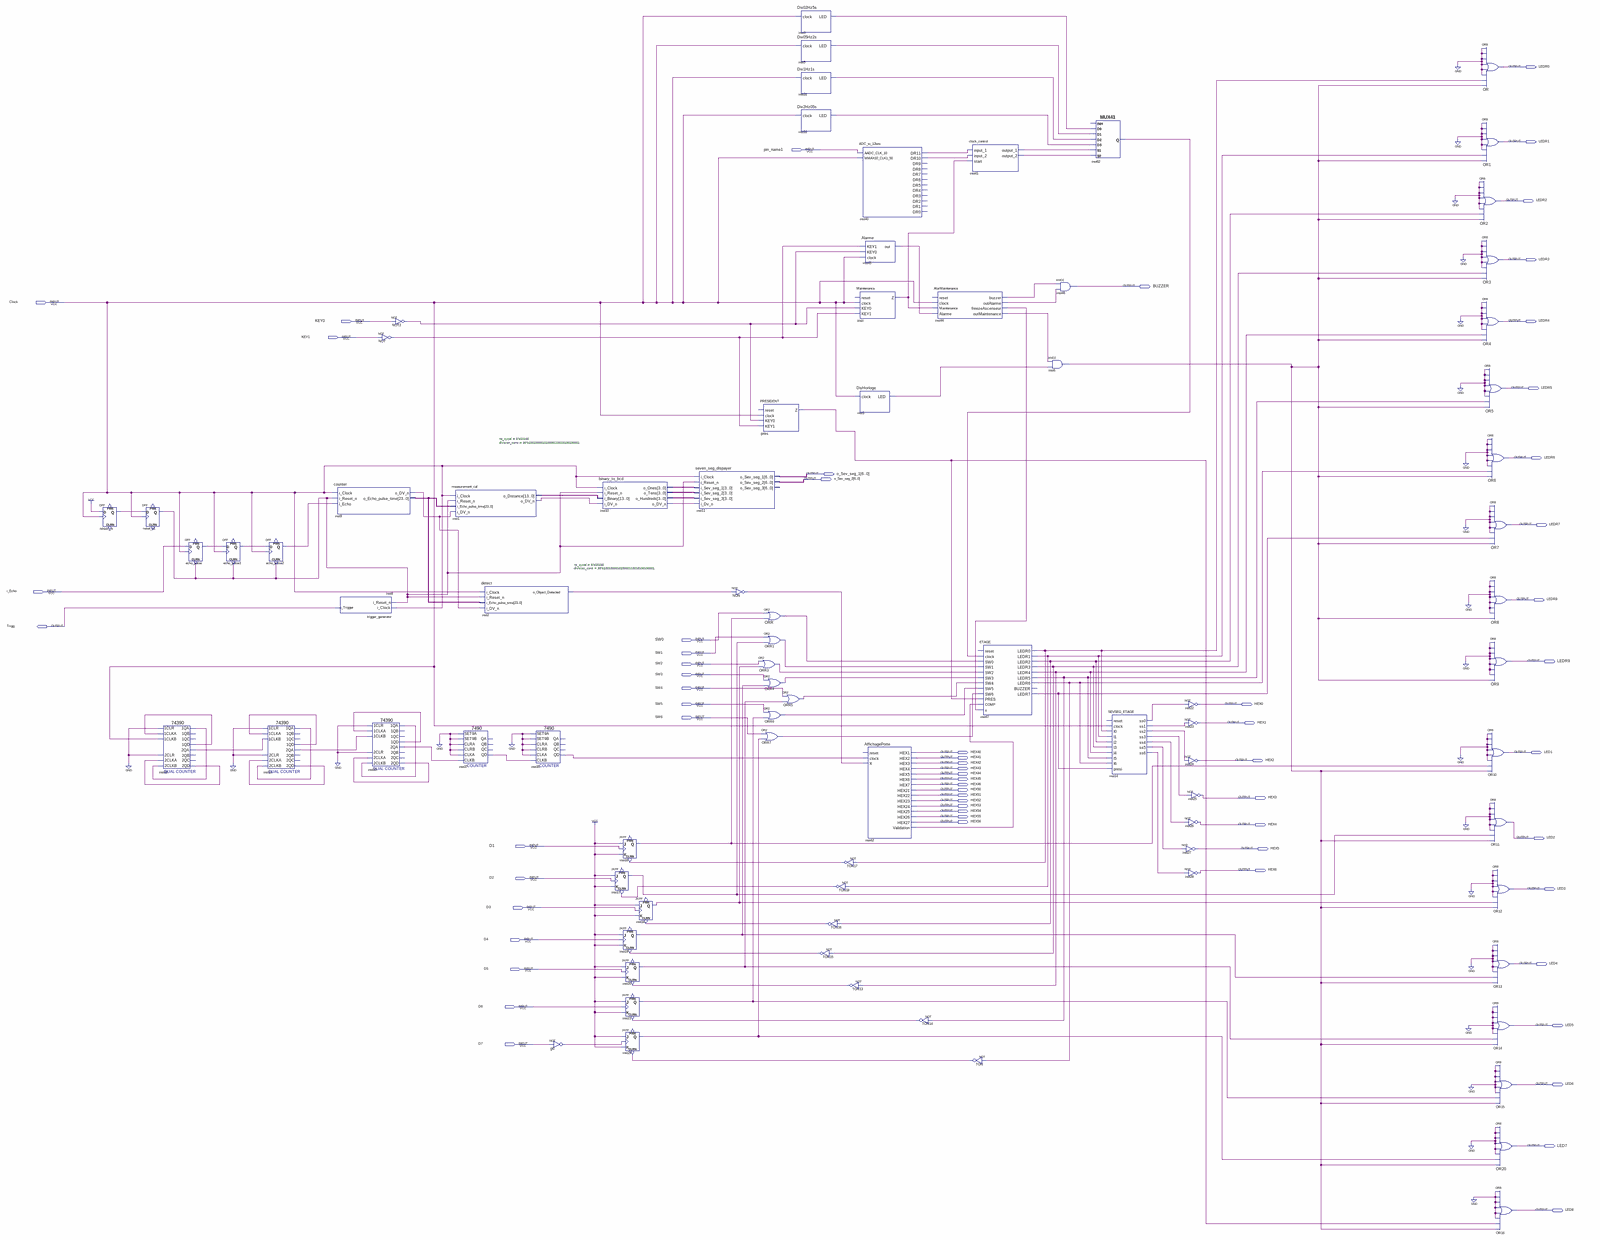
[diagram p0: schematic sheet, whole]
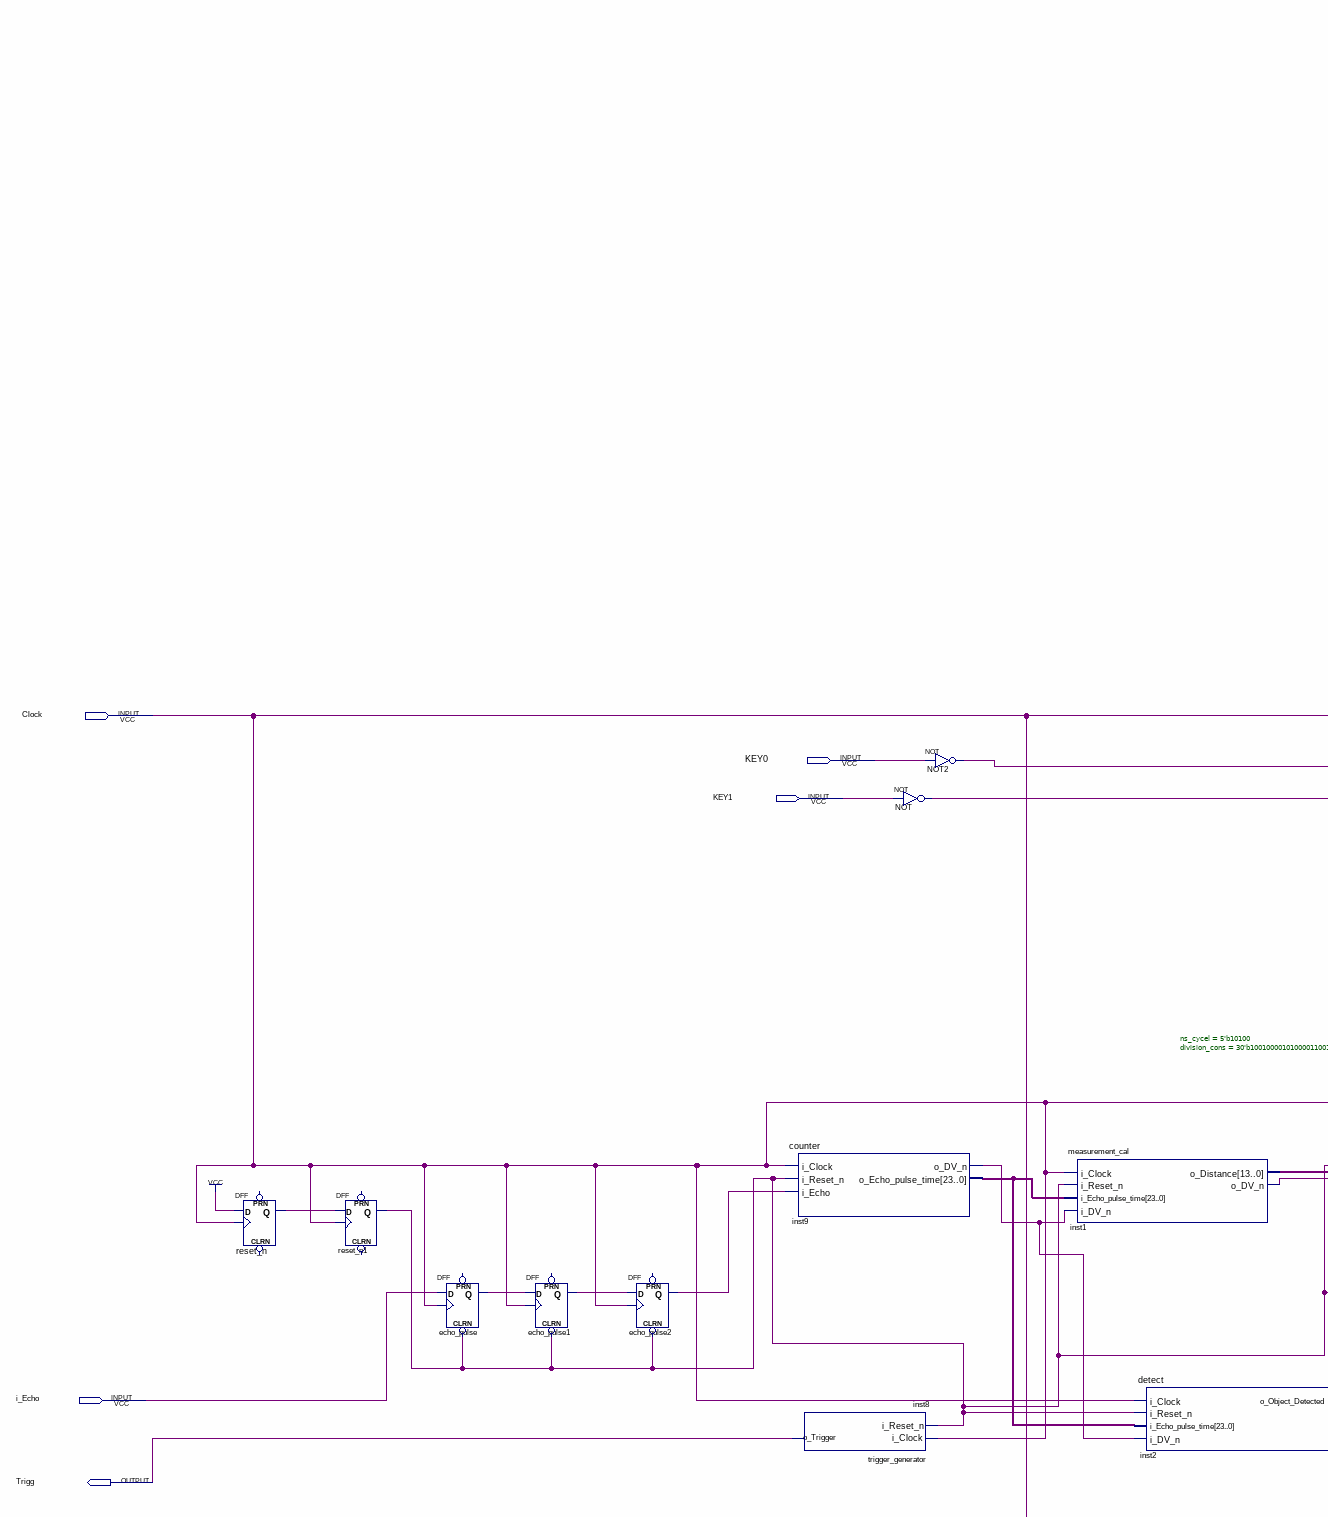
[diagram p1: schematic sheet, upper left part]
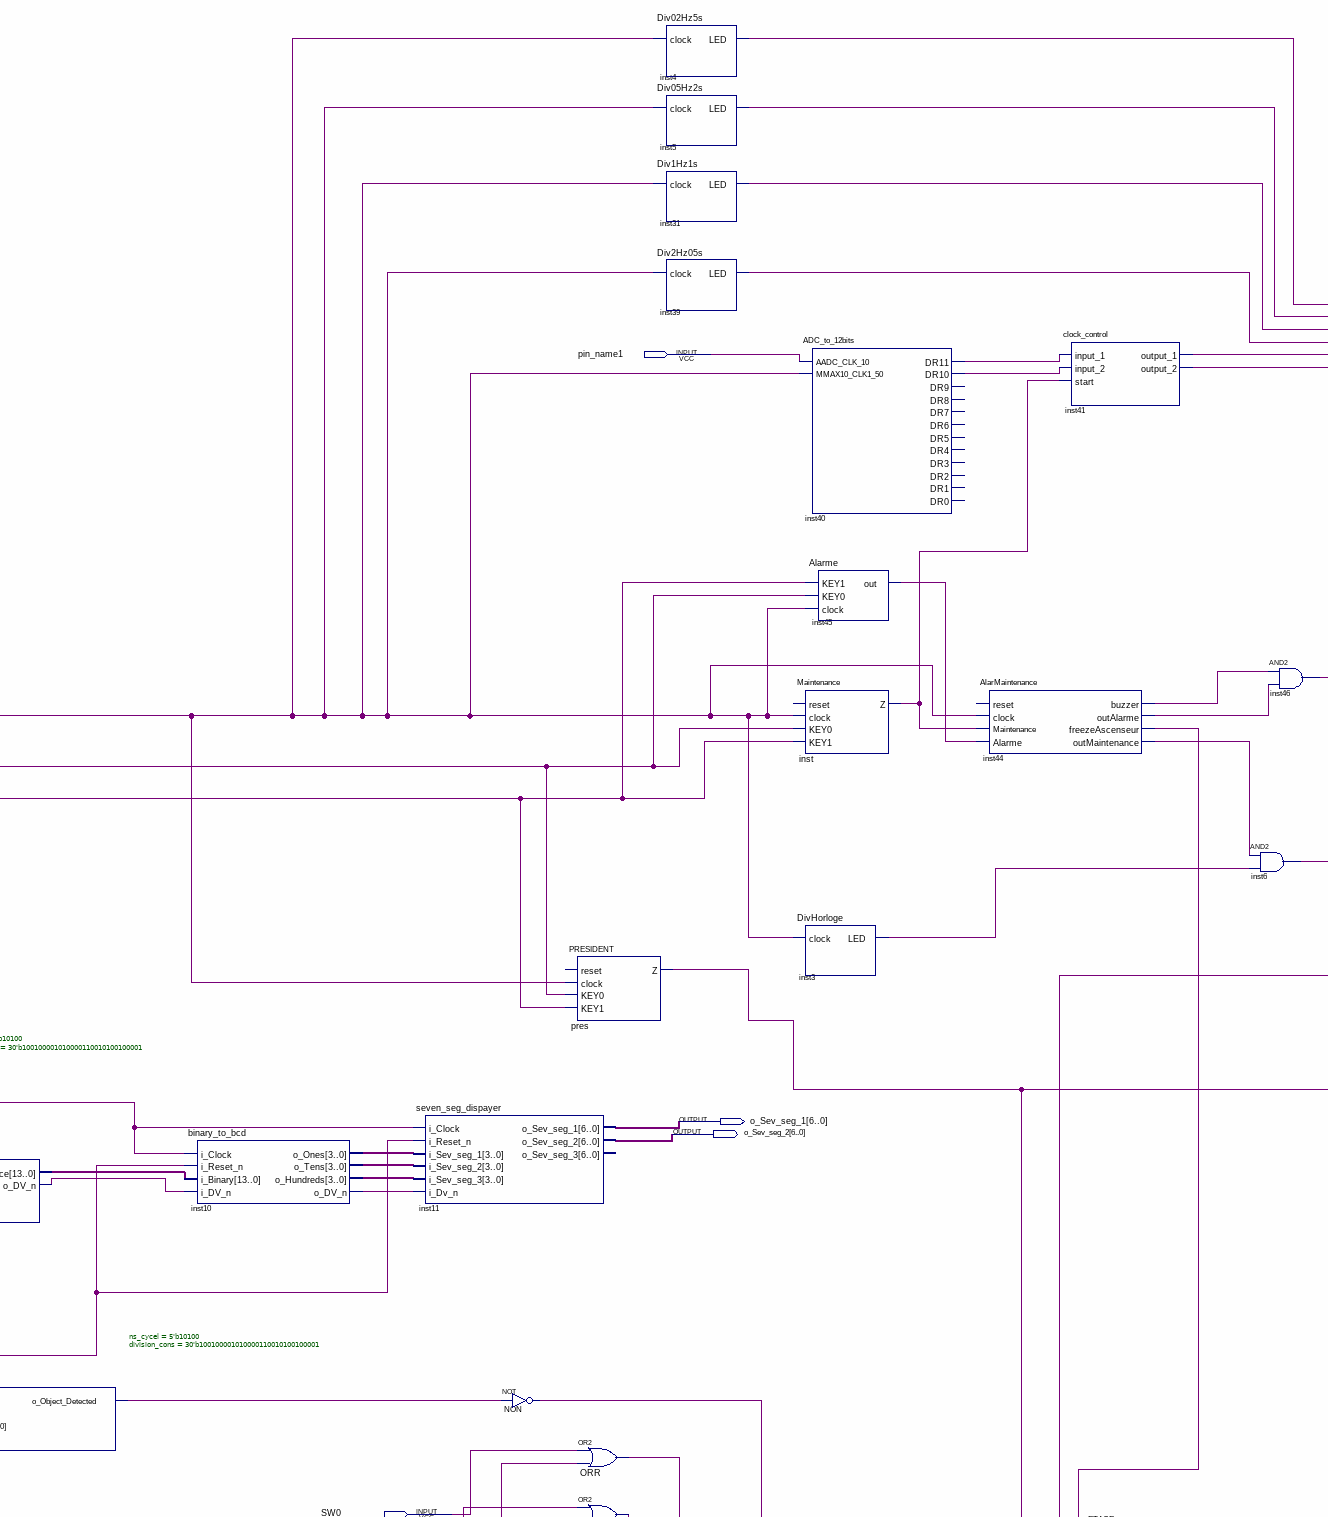
[diagram p2: schematic sheet, upper centre part]
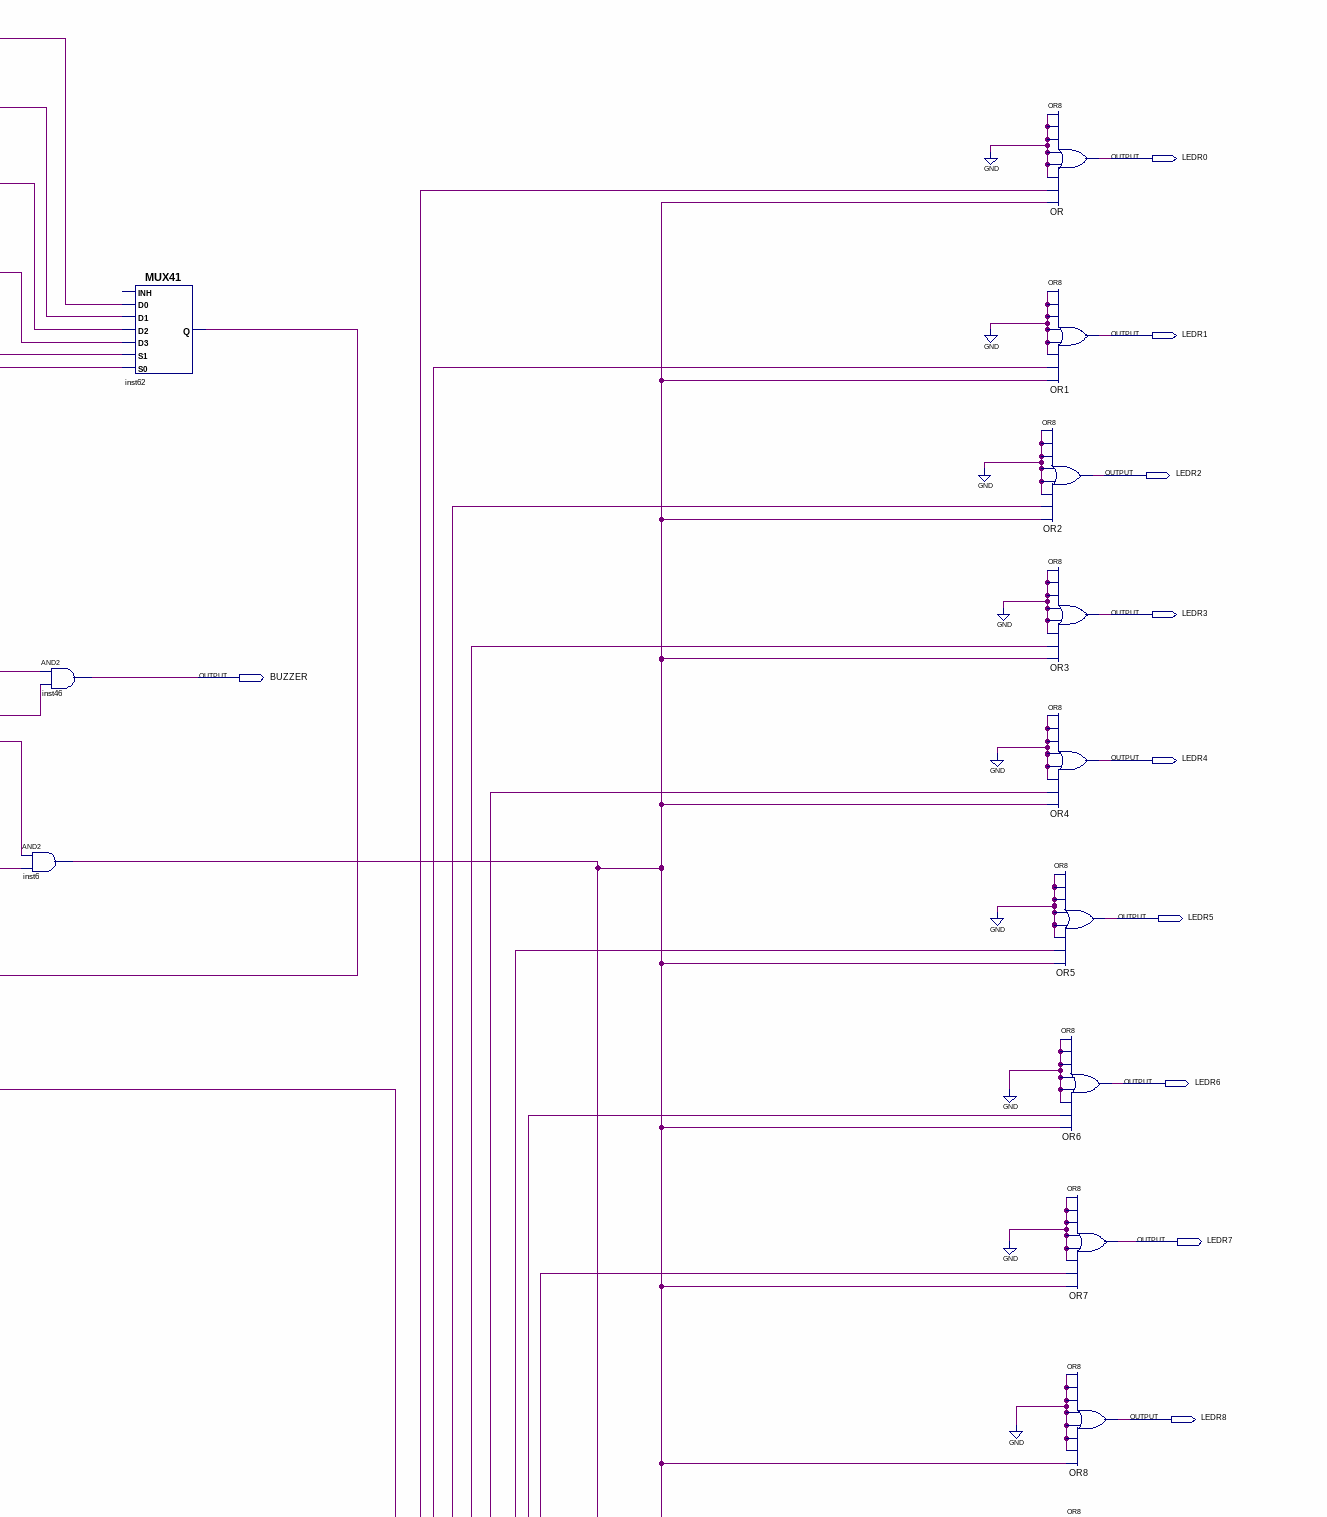
[diagram p3: schematic sheet, upper right part]
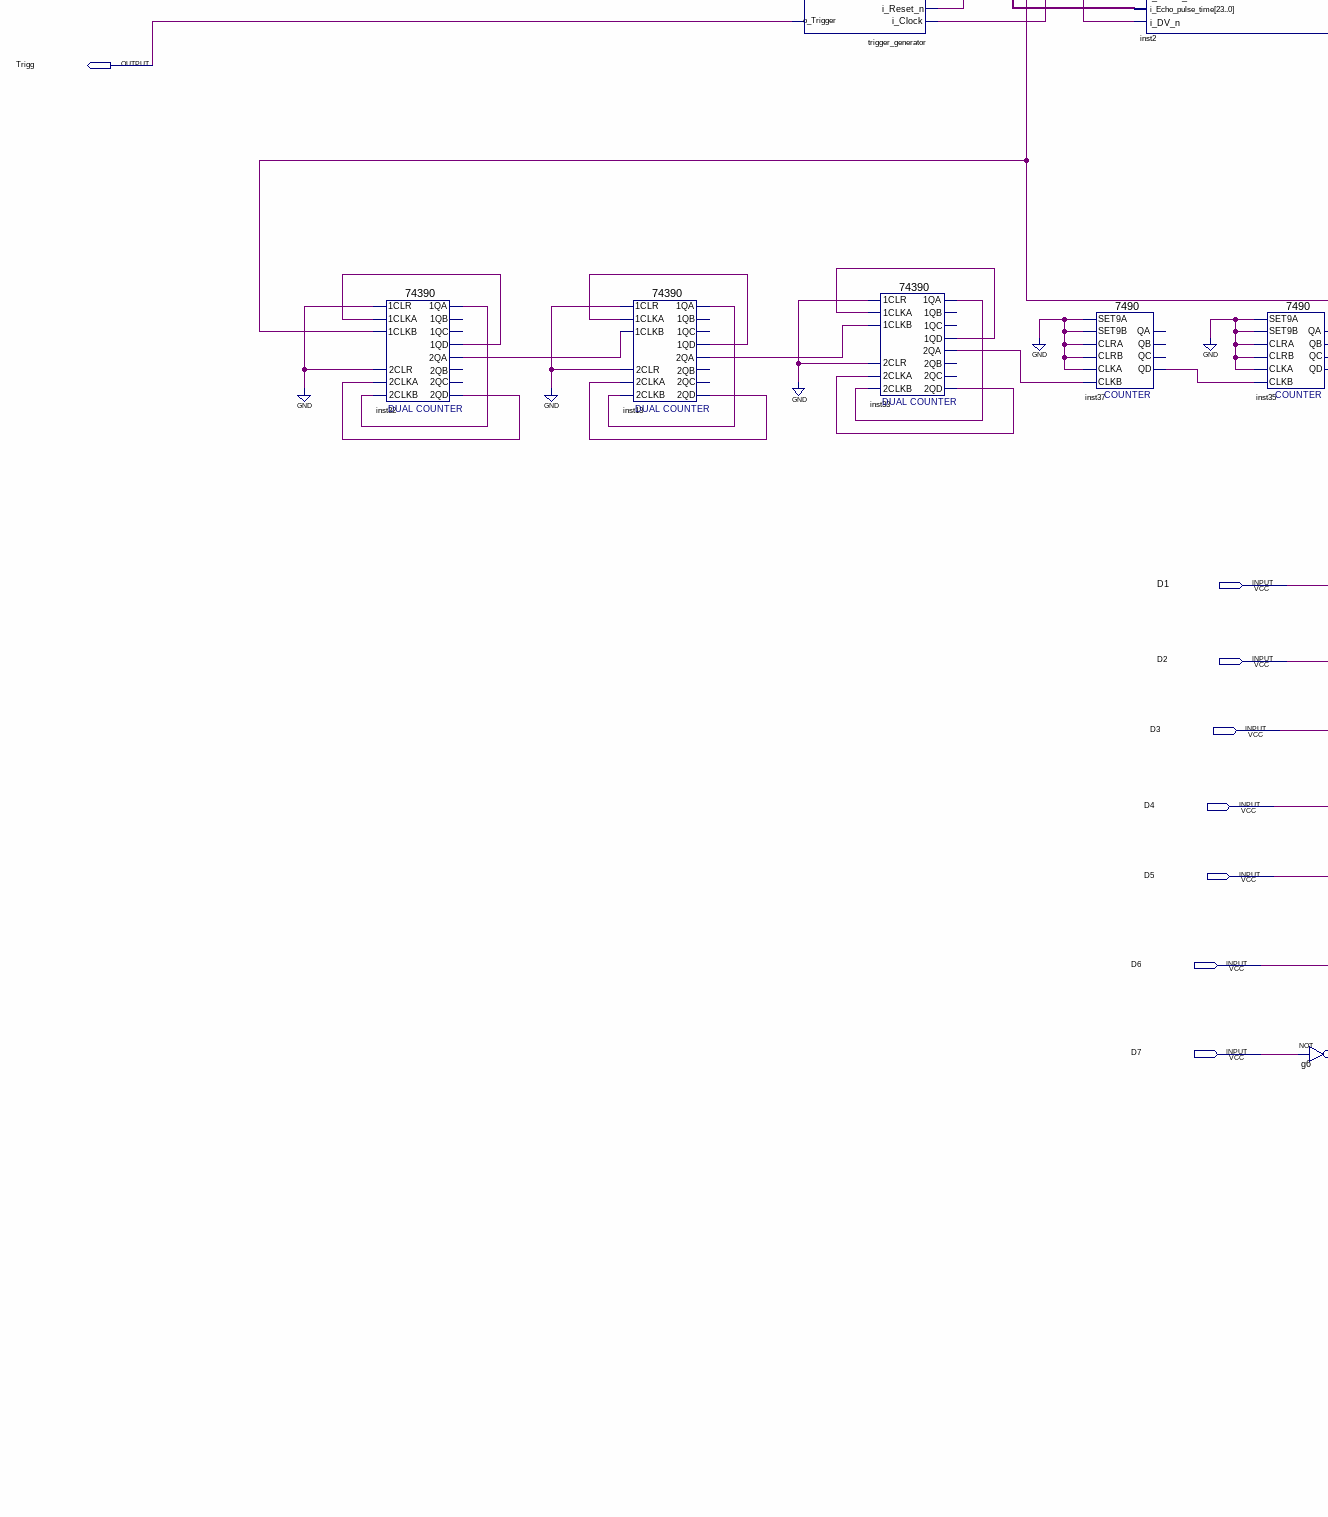
[diagram p4: schematic sheet, lower left part]
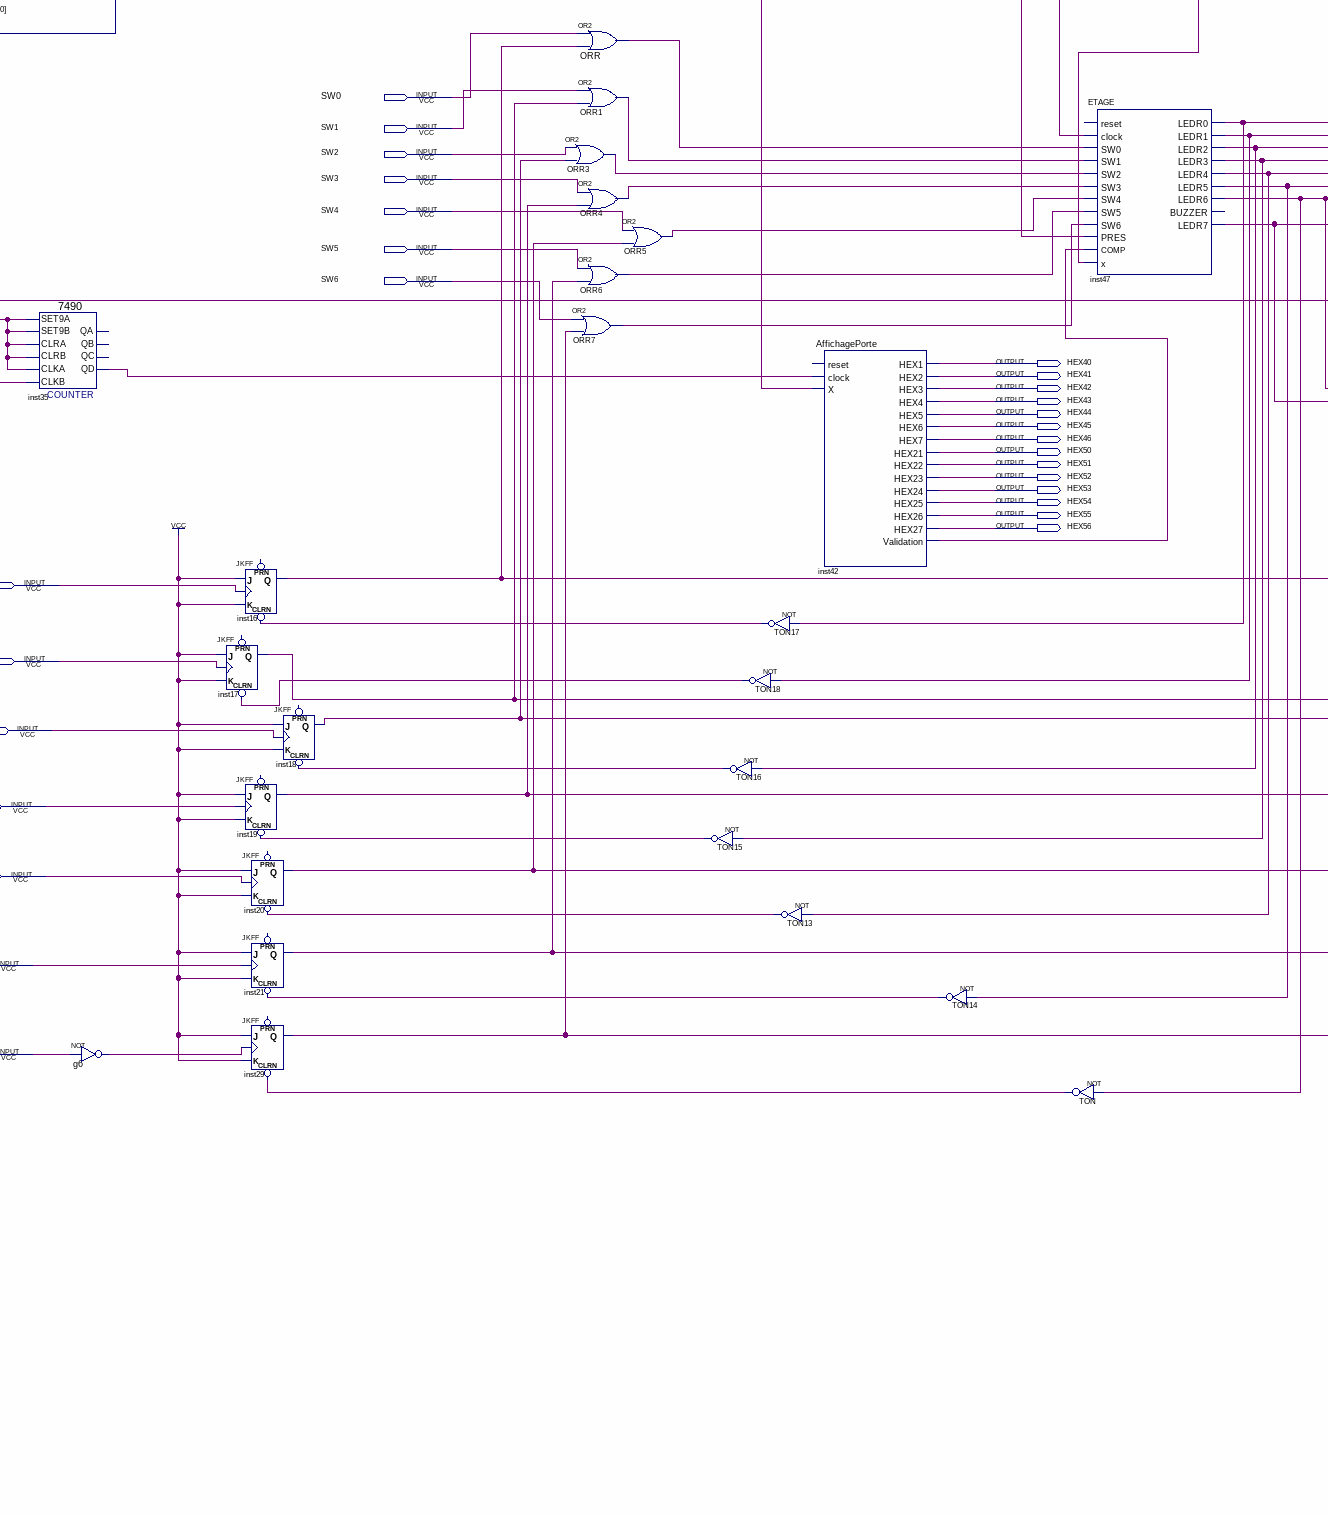
[diagram p5: schematic sheet, lower centre part]
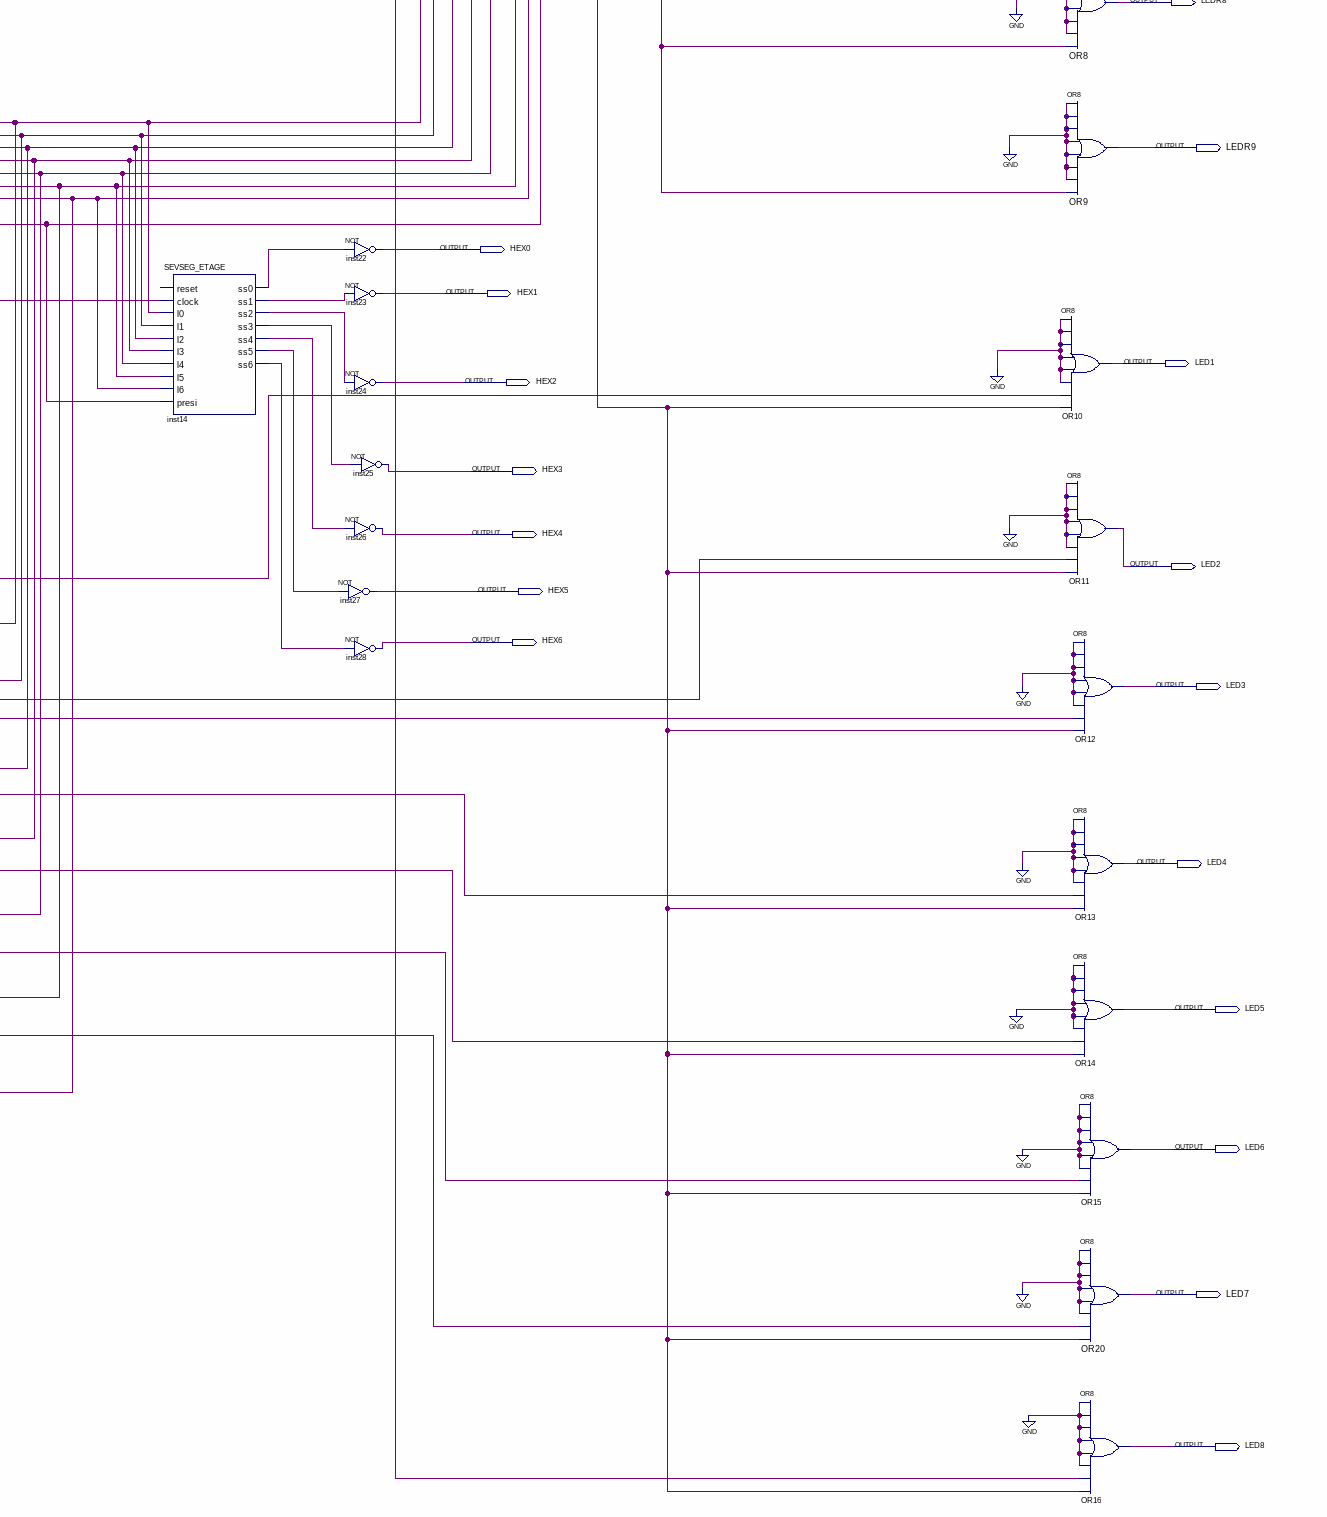
[diagram p6: schematic sheet, lower right part]
// Quartus schematic Quartus.bdf as structural Verilog: 83 symbols, 62 pins
module Quartus (
  input  pin_name1,
  input  Clock,
  input  KEY0,
  input  KEY1,
  input  i_Echo,
  input  SW0,
  input  SW1,
  input  SW2,
  input  SW3,
  input  SW4,
  input  SW5,
  input  SW6,
  input  D1,
  input  D2,
  input  D3,
  input  D4,
  input  D5,
  input  D6,
  input  D7,
  output LEDR0,
  output LEDR1,
  output LEDR2,
  output LEDR3,
  output BUZZER,
  output LEDR4,
  output LEDR5,
  output LEDR6,
  output [6:0] o_Sev_seg_1,
  output [6:0] o_Sev_seg_2,
  output LEDR7,
  output LEDR8,
  output Trigg,
  output LEDR9,
  output HEX0,
  output HEX1,
  output HEX40,
  output LED1,
  output HEX41,
  output HEX2,
  output HEX42,
  output HEX43,
  output HEX44,
  output HEX45,
  output HEX46,
  output HEX50,
  output HEX51,
  output HEX3,
  output HEX52,
  output HEX53,
  output HEX54,
  output HEX55,
  output HEX56,
  output HEX4,
  output LED2,
  output HEX5,
  output HEX6,
  output LED3,
  output LED4,
  output LED5,
  output LED6,
  output LED7,
  output LED8
);

  wire echo_pulse1_q, echo_pulse2_q, echo_pulse_q, g6_out, inst1_o_dv_n, inst2_o_object_detected, inst3_led,
       inst4_led, inst5_led, inst6_out, inst9_o_dv_n, inst10_o_dv_n, inst13_1qa, inst13_1qd, inst13_2qa,
       inst13_2qd, inst14_ss0, inst14_ss1, inst14_ss2, inst14_ss3, inst14_ss4, inst14_ss5, inst14_ss6,
       inst16_q, inst17_q, inst18_q, inst19_q, inst20_q, inst21_q, inst29_q, inst31_led, inst32_1qa,
       inst32_1qd, inst32_2qa, inst32_2qd, inst33_1qa, inst33_1qd, inst33_2qa, inst33_2qd, inst35_qd,
       inst37_qd, inst39_led, inst40_dr10, inst40_dr11, inst41_output_1, inst41_output_2, inst42_validation,
       inst44_buzzer, inst44_freezeascenseur, inst44_outalarme, inst44_outmaintenance, inst45_out,
       inst47_ledr0, inst47_ledr1, inst47_ledr2, inst47_ledr3, inst47_ledr4, inst47_ledr5, inst47_ledr6,
       inst47_ledr7, inst62_q, inst_z, NON_out, NOT2_out, NOT_out, ORR1_out, ORR3_out, ORR4_out, ORR5_out,
       ORR6_out, ORR7_out, ORR_out, pres_z, reset_n1_q, reset_n_q, TON13_out, TON14_out, TON15_out,
       TON16_out, TON17_out, TON18_out, TON_out;
  wire [3:0] inst10_o_hundreds, inst10_o_ones, inst10_o_tens;
  wire [13:0] inst1_o_distance;
  wire [23:0] inst9_o_echo_pulse_time;

  DFF reset_n (.CLK(Clock), .D(1'b1), .Q(reset_n_q));  // open: CLRN, PRN
  DFF reset_n1 (.CLK(Clock), .D(reset_n_q), .Q(reset_n1_q));  // open: CLRN, PRN
  \74390  inst32 (
    .\2CLKA (inst32_2qd), .\2CLR (1'b0), .\2CLKB (inst32_1qa), .\1CLR (1'b0), .\1CLKA (inst32_1qd),
    .\1CLKB (Clock), .\1QA (inst32_1qa), .\1QD (inst32_1qd), .\2QA (inst32_2qa), .\2QD (inst32_2qd));  // open: 1QB, 1QC, 2QB, 2QC
  DFF echo_pulse (.CLRN(reset_n1_q), .CLK(Clock), .D(i_Echo), .Q(echo_pulse_q));  // open: PRN
  DFF echo_pulse1 (.CLRN(reset_n1_q), .CLK(Clock), .D(echo_pulse_q), .Q(echo_pulse1_q));  // open: PRN
  DFF echo_pulse2 (.CLRN(reset_n1_q), .CLK(Clock), .D(echo_pulse1_q), .Q(echo_pulse2_q));  // open: PRN
  \74390  inst13 (
    .\2CLKA (inst13_2qd), .\2CLR (1'b0), .\2CLKB (inst13_1qa), .\1CLR (1'b0), .\1CLKA (inst13_1qd),
    .\1CLKB (inst32_2qa), .\1QA (inst13_1qa), .\1QD (inst13_1qd), .\2QA (inst13_2qa), .\2QD (inst13_2qd));  // open: 1QB, 1QC, 2QB, 2QC
  counter inst9 (
    .i_Clock(Clock), .i_Reset_n(reset_n1_q), .i_Echo(echo_pulse2_q), .o_DV_n(inst9_o_dv_n),
    .o_Echo_pulse_time(inst9_o_echo_pulse_time));
  trigger_generator inst8 (.i_Clock(Clock), .i_Reset_n(reset_n1_q), .o_Trigger(Trigg));
  not NOT (NOT_out, KEY1);
  \74390  inst33 (
    .\2CLKA (inst33_2qd), .\2CLR (1'b0), .\2CLKB (inst33_1qa), .\1CLR (1'b0), .\1CLKA (inst33_1qd),
    .\1CLKB (inst13_2qa), .\1QA (inst33_1qa), .\1QD (inst33_1qd), .\2QA (inst33_2qa), .\2QD (inst33_2qd));  // open: 1QB, 1QC, 2QB, 2QC
  not NOT2 (NOT2_out, KEY0);
  measurement_cal #(.ns_cycel(5'b10100), .division_cons(30'b100100001010000110010100100001)) inst1 (
    .i_Clock(Clock), .i_Reset_n(reset_n1_q), .i_Echo_pulse_time(inst9_o_echo_pulse_time),
    .i_DV_n(inst9_o_dv_n), .o_Distance(inst1_o_distance), .o_DV_n(inst1_o_dv_n));
  \7490  inst37 (
    .SET9A(1'b0), .CLRA(1'b0), .SET9B(1'b0), .CLKB(inst33_2qa), .CLKA(1'b0), .CLRB(1'b0), .QD(inst37_qd));  // open: QA, QB, QC
  detect #(.ns_cycel(5'b10100), .division_cons(30'b100100001010000110010100100001)) inst2 (
    .i_Clock(Clock), .i_Reset_n(reset_n1_q), .i_Echo_pulse_time(inst9_o_echo_pulse_time),
    .i_DV_n(inst9_o_dv_n), .o_Object_Detected(inst2_o_object_detected));
  \7490  inst35 (
    .SET9A(1'b0), .CLRA(1'b0), .SET9B(1'b0), .CLKB(inst37_qd), .CLKA(1'b0), .CLRB(1'b0), .QD(inst35_qd));  // open: QA, QB, QC
  not g6 (g6_out, D7);
  binary_to_bcd inst10 (
    .i_Clock(Clock), .i_Reset_n(reset_n1_q), .i_Binary(inst1_o_distance), .i_DV_n(inst1_o_dv_n),
    .o_Ones(inst10_o_ones), .o_Tens(inst10_o_tens), .o_Hundreds(inst10_o_hundreds), .o_DV_n(inst10_o_dv_n));
  JKFF inst16 (.CLRN(TON17_out), .K(1'b1), .J(1'b1), .CLK(D1), .Q(inst16_q));  // open: PRN
  JKFF inst17 (.CLRN(TON18_out), .K(1'b1), .J(1'b1), .CLK(D2), .Q(inst17_q));  // open: PRN
  JKFF inst19 (.CLRN(TON15_out), .K(1'b1), .J(1'b1), .CLK(D4), .Q(inst19_q));  // open: PRN
  JKFF inst18 (.CLRN(TON16_out), .K(1'b1), .J(1'b1), .CLK(D3), .Q(inst18_q));  // open: PRN
  JKFF inst20 (.CLRN(TON13_out), .K(1'b1), .J(1'b1), .CLK(D5), .Q(inst20_q));  // open: PRN
  JKFF inst21 (.CLRN(TON14_out), .K(1'b1), .J(1'b1), .CLK(D6), .Q(inst21_q));  // open: PRN
  JKFF inst29 (.CLRN(TON_out), .K(1'b1), .J(1'b1), .CLK(g6_out), .Q(inst29_q));  // open: PRN
  seven_seg_dispayer inst11 (
    .i_Clock(Clock), .i_Reset_n(reset_n1_q), .i_Sev_seg_1(inst10_o_ones), .i_Sev_seg_2(inst10_o_tens),
    .i_Sev_seg_3(inst10_o_hundreds), .i_Dv_n(inst10_o_dv_n), .o_Sev_seg_1(o_Sev_seg_1),
    .o_Sev_seg_2(o_Sev_seg_2));  // open: o_Sev_seg_3
  not NON (NON_out, inst2_o_object_detected);
  PRESIDENT pres (.clock(Clock), .KEY0(NOT2_out), .KEY1(NOT_out), .Z(pres_z));  // open: reset
  or ORR (ORR_out, SW0, inst16_q);
  or ORR1 (ORR1_out, SW1, inst17_q);
  or ORR3 (ORR3_out, SW2, inst18_q);
  or ORR4 (ORR4_out, SW3, inst19_q);
  or ORR6 (ORR6_out, SW5, inst21_q);
  or ORR7 (ORR7_out, SW6, inst29_q);
  or ORR5 (ORR5_out, SW4, inst20_q);
  Div02Hz5s inst4 (.clock(Clock), .LED(inst4_led));
  Div05Hz2s inst5 (.clock(Clock), .LED(inst5_led));
  Div1Hz1s inst31 (.clock(Clock), .LED(inst31_led));
  Div2Hz05s inst39 (.clock(Clock), .LED(inst39_led));
  not TON18 (TON18_out, inst47_ledr1);
  not TON16 (TON16_out, inst47_ledr2);
  not TON15 (TON15_out, inst47_ledr3);
  Maintenance inst (.clock(Clock), .KEY0(NOT2_out), .KEY1(NOT_out), .Z(inst_z));  // open: reset
  DivHorloge inst3 (.clock(Clock), .LED(inst3_led));
  not TON17 (TON17_out, inst47_ledr0);
  not TON13 (TON13_out, inst47_ledr4);
  ADC_to_12bits inst40 (
    .AADC_CLK_10(pin_name1), .MMAX10_CLK1_50(Clock), .DR11(inst40_dr11), .DR10(inst40_dr10));  // open: DR9, DR8, DR7, DR6, DR5, DR4, DR3, DR2, DR1, DR0
  Alarme inst45 (.KEY1(NOT_out), .KEY0(NOT2_out), .clock(Clock), .out(inst45_out));
  AffichagePorte inst42 (
    .clock(inst35_qd), .X(NON_out), .HEX1(HEX40), .HEX2(HEX41), .HEX3(HEX42), .HEX4(HEX43), .HEX5(HEX44),
    .HEX6(HEX45), .HEX7(HEX46), .HEX21(HEX50), .HEX22(HEX51), .HEX23(HEX52), .HEX24(HEX53), .HEX25(HEX54),
    .HEX26(HEX55), .HEX27(HEX56), .Validation(inst42_validation));  // open: reset
  not TON14 (TON14_out, inst47_ledr5);
  AlarMaintenance inst44 (
    .clock(Clock), .Maintenance(inst_z), .Alarme(inst45_out), .buzzer(inst44_buzzer),
    .outAlarme(inst44_outalarme), .freezeAscenseur(inst44_freezeascenseur),
    .outMaintenance(inst44_outmaintenance));  // open: reset
  clock_control inst41 (
    .input_1(inst40_dr11), .input_2(inst40_dr10), .start(inst_z), .output_1(inst41_output_1),
    .output_2(inst41_output_2));
  ETAGE inst47 (
    .clock(inst62_q), .SW0(ORR_out), .SW1(ORR1_out), .SW2(ORR3_out), .SW3(ORR4_out), .SW4(ORR5_out),
    .SW5(ORR6_out), .SW6(ORR7_out), .PRES(pres_z), .COMP(inst42_validation), .x(inst44_freezeascenseur),
    .LEDR0(inst47_ledr0), .LEDR1(inst47_ledr1), .LEDR2(inst47_ledr2), .LEDR3(inst47_ledr3),
    .LEDR4(inst47_ledr4), .LEDR5(inst47_ledr5), .LEDR6(inst47_ledr6), .LEDR7(inst47_ledr7));  // open: reset, BUZZER
  not TON (TON_out, inst47_ledr6);
  and inst6 (inst6_out, inst44_outmaintenance, inst3_led);
  and inst46 (BUZZER, inst44_buzzer, inst44_outalarme);
  MUX41 inst62 (
    .S0(inst41_output_2), .D2(inst31_led), .S1(inst41_output_1), .D3(inst39_led), .D0(inst4_led),
    .D1(inst5_led), .Q(inst62_q));  // open: INH
  SEVSEG_ETAGE inst14 (
    .clock(Clock), .l0(inst47_ledr0), .l1(inst47_ledr1), .l2(inst47_ledr2), .l3(inst47_ledr3),
    .l4(inst47_ledr4), .l5(inst47_ledr5), .l6(inst47_ledr6), .presi(inst47_ledr7), .ss0(inst14_ss0),
    .ss1(inst14_ss1), .ss2(inst14_ss2), .ss3(inst14_ss3), .ss4(inst14_ss4), .ss5(inst14_ss5), .ss6(inst14_ss6));  // open: reset
  not inst22 (HEX0, inst14_ss0);
  not inst23 (HEX1, inst14_ss1);
  not inst24 (HEX2, inst14_ss2);
  not inst25 (HEX3, inst14_ss3);
  not inst26 (HEX4, inst14_ss4);
  not inst27 (HEX5, inst14_ss5);
  not inst28 (HEX6, inst14_ss6);
  or OR (LEDR0, 1'b0, 1'b0, 1'b0, 1'b0, 1'b0, 1'b0, inst47_ledr0, inst6_out);
  or OR1 (LEDR1, 1'b0, 1'b0, 1'b0, 1'b0, 1'b0, 1'b0, inst47_ledr1, inst6_out);
  or OR2 (LEDR2, 1'b0, 1'b0, 1'b0, 1'b0, 1'b0, 1'b0, inst47_ledr2, inst6_out);
  or OR3 (LEDR3, 1'b0, 1'b0, 1'b0, 1'b0, 1'b0, 1'b0, inst47_ledr3, inst6_out);
  or OR4 (LEDR4, 1'b0, 1'b0, 1'b0, 1'b0, 1'b0, 1'b0, inst47_ledr4, inst6_out);
  or OR5 (LEDR5, 1'b0, 1'b0, 1'b0, 1'b0, 1'b0, 1'b0, inst47_ledr5, inst6_out);
  or OR6 (LEDR6, 1'b0, 1'b0, 1'b0, 1'b0, 1'b0, 1'b0, inst47_ledr6, inst6_out);
  or OR7 (LEDR7, 1'b0, 1'b0, 1'b0, 1'b0, 1'b0, 1'b0, inst47_ledr7, inst6_out);
  or OR8 (LEDR8, 1'b0, 1'b0, 1'b0, 1'b0, 1'b0, 1'b0, 1'b0, inst6_out);
  or OR9 (LEDR9, 1'b0, 1'b0, 1'b0, 1'b0, 1'b0, 1'b0, 1'b0, inst6_out);
  or OR10 (LED1, 1'b0, 1'b0, 1'b0, 1'b0, 1'b0, 1'b0, inst16_q, inst6_out);
  or OR11 (LED2, 1'b0, 1'b0, 1'b0, 1'b0, 1'b0, 1'b0, inst17_q, inst6_out);
  or OR12 (LED3, 1'b0, 1'b0, 1'b0, 1'b0, 1'b0, 1'b0, inst18_q, inst6_out);
  or OR13 (LED4, 1'b0, 1'b0, 1'b0, 1'b0, 1'b0, 1'b0, inst19_q, inst6_out);
  or OR14 (LED5, 1'b0, 1'b0, 1'b0, 1'b0, 1'b0, 1'b0, inst20_q, inst6_out);
  or OR15 (LED6, 1'b0, 1'b0, 1'b0, 1'b0, 1'b0, 1'b0, inst21_q, inst6_out);
  or OR20 (LED7, 1'b0, 1'b0, 1'b0, 1'b0, 1'b0, 1'b0, inst29_q, inst6_out);
  or OR16 (LED8, 1'b0, 1'b0, 1'b0, 1'b0, 1'b0, 1'b0, pres_z, inst6_out);
endmodule
